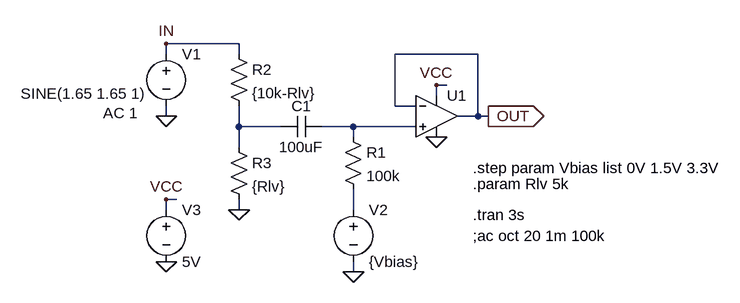
[diagram p0: schematic ArduinoLFO_NonInv_Bias_Level.asc]
ArduinoLFO_NonInv_Bias_Level.asc, the LTspice schematic file:
Version 4
SHEET 1 1176 680
WIRE 368 64 256 64
WIRE 256 80 256 64
WIRE 368 80 368 64
WIRE 736 80 608 80
WIRE 688 128 672 128
WIRE 672 144 672 128
WIRE 608 160 608 80
WIRE 640 160 608 160
WIRE 256 176 256 160
WIRE 736 176 736 80
WIRE 736 176 704 176
WIRE 752 176 736 176
WIRE 368 192 368 160
WIRE 432 192 368 192
WIRE 544 192 496 192
WIRE 640 192 544 192
WIRE 544 208 544 192
WIRE 368 224 368 192
WIRE 272 304 256 304
WIRE 256 320 256 304
WIRE 368 320 368 304
WIRE 544 320 544 288
WIRE 544 416 544 400
FLAG 544 416 0
FLAG 256 176 0
FLAG 672 128 VCC
FLAG 752 176 OUT
IOPIN 752 176 Out
FLAG 672 208 0
FLAG 256 400 0
FLAG 256 304 VCC
FLAG 256 64 IN
FLAG 368 320 0
SYMBOL Opamps\\UniversalOpamp2 672 176 R0
SYMATTR InstName U1
SYMBOL voltage 256 64 R0
WINDOW 123 -97 107 Left 2
WINDOW 39 0 0 Left 2
WINDOW 3 -224 77 Left 2
SYMATTR Value2 AC 1
SYMATTR Value SINE(1.65 1.65 1)
SYMATTR InstName V1
SYMBOL cap 496 176 R90
WINDOW 0 0 32 VBottom 2
WINDOW 3 32 32 VTop 2
SYMATTR InstName C1
SYMATTR Value 100uF
SYMBOL res 528 192 R0
SYMATTR InstName R1
SYMATTR Value 100k
SYMBOL voltage 544 304 R0
SYMATTR InstName V2
SYMATTR Value {Vbias}
SYMBOL voltage 256 304 R0
SYMATTR InstName V3
SYMATTR Value 5V
SYMBOL res 352 64 R0
SYMATTR InstName R2
SYMATTR Value {10k-Rlv}
SYMBOL res 352 208 R0
SYMATTR InstName R3
SYMATTR Value {Rlv}
TEXT 728 256 Left 2 !.step param Vbias list 0V 1.5V 3.3V
TEXT 728 328 Left 2 !.tran 3s
TEXT 728 360 Left 2 !;ac oct 20 1m 100k
TEXT 728 280 Left 2 !.param Rlv 5k

The netlist it stands for:
* ArduinoLFO_NonInv_Bias_Level.asc
XU1 N002 OUT VCC 0 OUT level.2 Avol=1Meg GBW=10Meg Slew=10Meg ilimit=25m rail=0 Vos=0 phimargin=45 en=0 enk=0 in=0 ink=0 Rin=500Meg  ; pins IN+ IN- V+ V- OUT
V1 IN 0 SINE(1.65 1.65 1) AC 1
C1 N002 N001 100uF
R1 N002 N003 100k
V2 N003 0 {Vbias}
V3 VCC 0 5V
R2 IN N001 {10k-Rlv}
R3 N001 0 {Rlv}
.step param Vbias list 0V 1.5V 3.3V
.tran 3s
;ac oct 20 1m 100k
.param Rlv 5k
.lib UniversalOpamps2.sub
.backanno
.end